# EAGLE design proto (EAGLE 6.6.0)
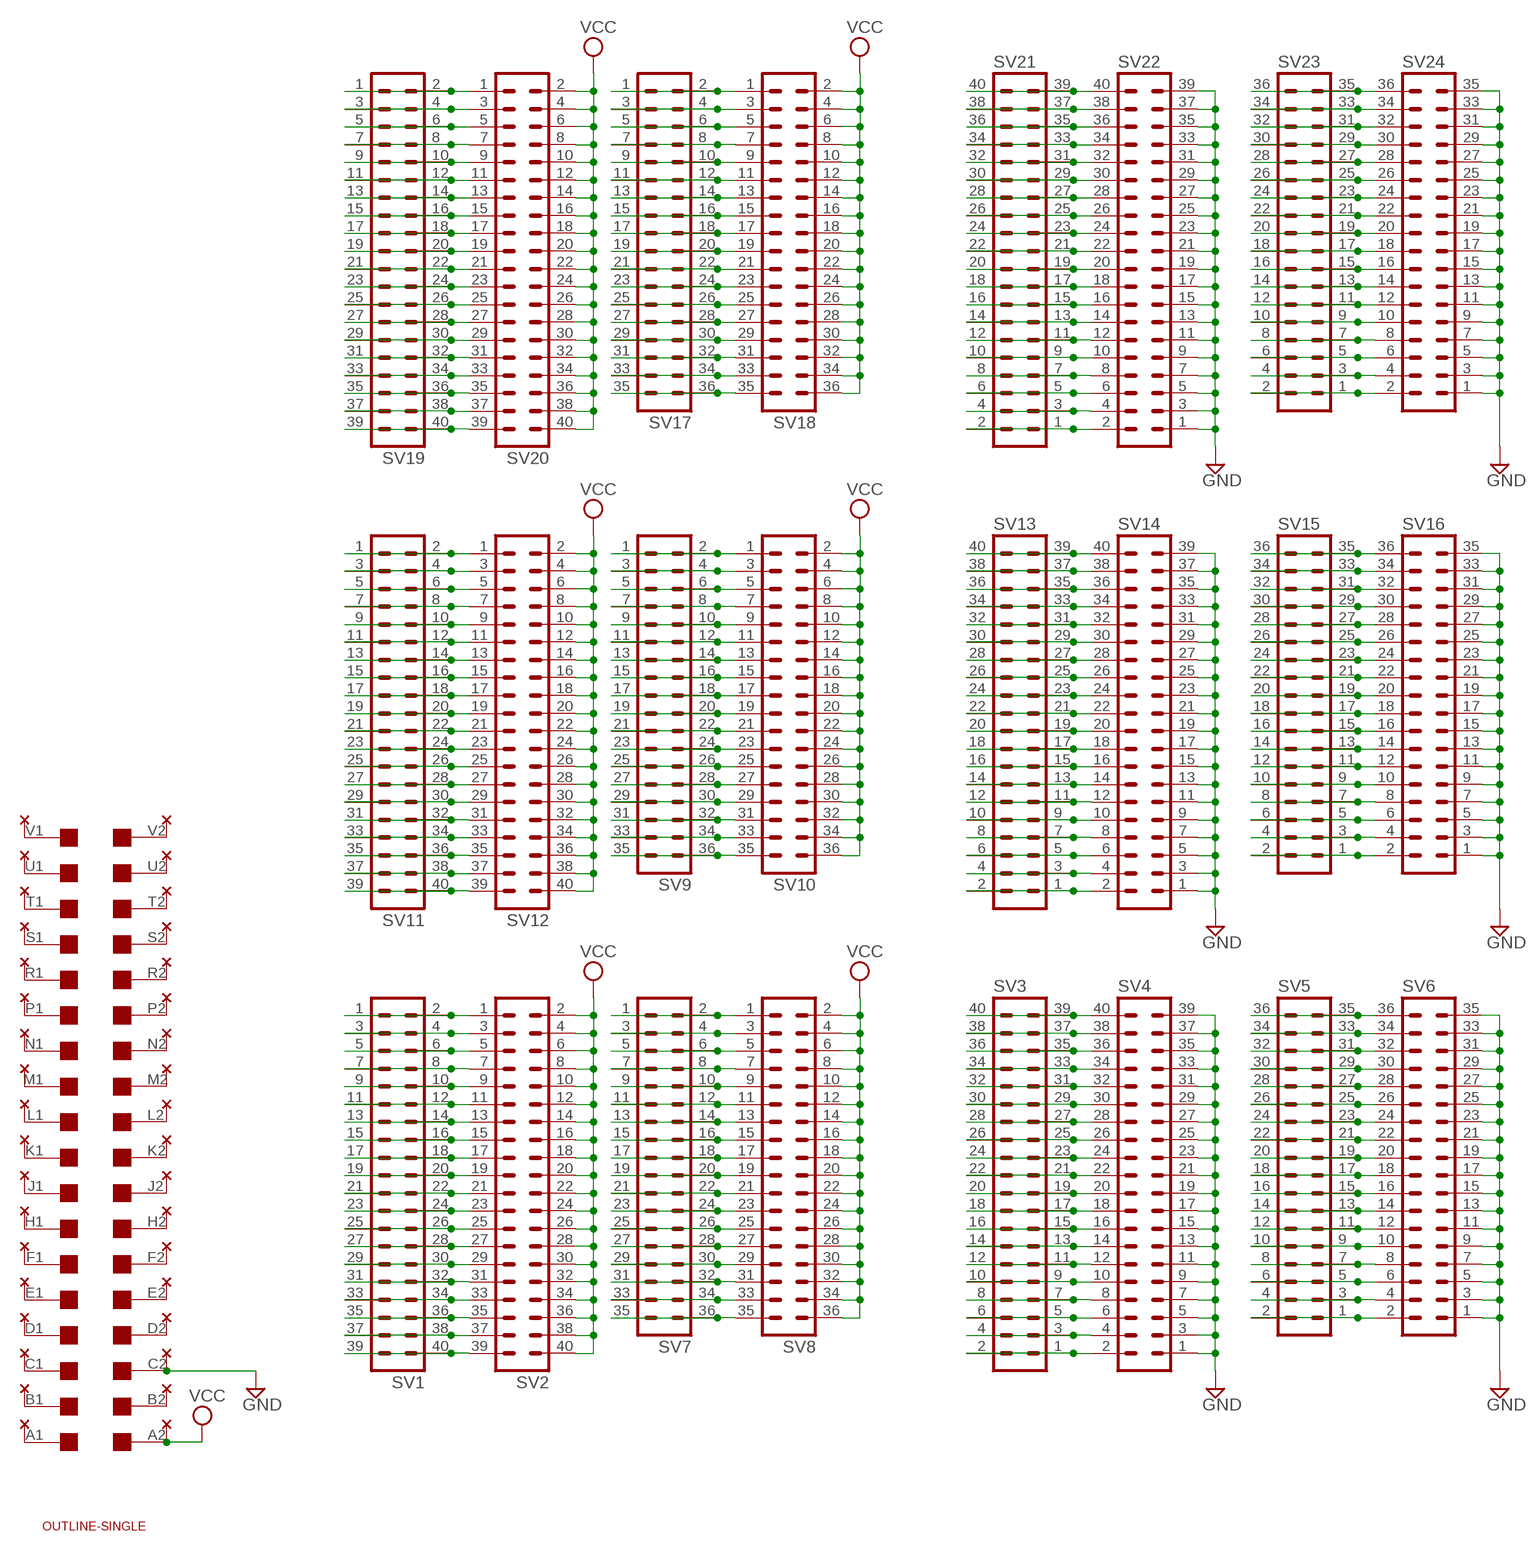
[diagram p0: schematic, sheet 1]

## Parts
SV1  MA20-2  [MA20-2]
SV2  MA20-2  [MA20-2]
SV3  MA20-2  [MA20-2]
SV4  MA20-2  [MA20-2]
SV5  MA18-2  [MA18-2]
SV6  MA18-2  [MA18-2]
SV7  MA18-2  [MA18-2]
SV8  MA18-2  [MA18-2]
SV9  MA18-2  [MA18-2]
SV10  MA18-2  [MA18-2]
SV11  MA20-2  [MA20-2]
SV12  MA20-2  [MA20-2]
SV13  MA20-2  [MA20-2]
SV14  MA20-2  [MA20-2]
SV15  MA18-2  [MA18-2]
SV16  MA18-2  [MA18-2]
SV17  MA18-2  [MA18-2]
SV18  MA18-2  [MA18-2]
SV19  MA20-2  [MA20-2]
SV20  MA20-2  [MA20-2]
SV21  MA20-2  [MA20-2]
SV22  MA20-2  [MA20-2]
SV23  MA18-2  [MA18-2]
SV24  MA18-2  [MA18-2]
U$1  EDGE-2CONNECTOR  [EDGE-CON2]
U$2  OUTLINE-SINGLE  [SINGLE]
U$3  THRU-HOLE2A  [THRU-HOLEA]

## Nets
GND: SV4.1 SV4.3 SV4.5 SV4.7 SV4.9 SV4.11 SV4.13 SV4.15 SV4.17 SV4.19 SV4.21 SV4.23 SV4.25 SV4.27 SV4.29 SV4.31 SV4.33 SV4.35 SV4.37 SV4.39 SV6.1 SV6.3 SV6.5 SV6.7 SV6.9 SV6.11 SV6.13 SV6.15 SV6.17 SV6.19 SV6.21 SV6.23 SV6.25 SV6.27 SV6.29 SV6.31 SV6.33 SV6.35 SV14.1 SV14.3 SV14.5 SV14.7 SV14.9 SV14.11 SV14.13 SV14.15 SV14.17 SV14.19 SV14.21 SV14.23 SV14.25 SV14.27 SV14.29 SV14.31 SV14.33 SV14.35 SV14.37 SV14.39 SV16.1 SV16.3 SV16.5 SV16.7 SV16.9 SV16.11 SV16.13 SV16.15 SV16.17 SV16.19 SV16.21 SV16.23 SV16.25 SV16.27 SV16.29 SV16.31 SV16.33 SV16.35 SV22.1 SV22.3 SV22.5 SV22.7 SV22.9 SV22.11 SV22.13 SV22.15 SV22.17 SV22.19 SV22.21 SV22.23 SV22.25 SV22.27 SV22.29 SV22.31 SV22.33 SV22.35 SV22.37 SV22.39 SV24.1 SV24.3 SV24.5 SV24.7 SV24.9 SV24.11 SV24.13 SV24.15 SV24.17 SV24.19 SV24.21 SV24.23 SV24.25 SV24.27 SV24.29 SV24.31 SV24.33 SV24.35 U$1.C2 U$3.C2
N$1: U$1.K2 U$3.K2
N$2: U$1.J2 U$3.J2
N$3: U$1.H2 U$3.H2
N$4: U$1.L2 U$3.L2
N$5: U$1.M2 U$3.M2
N$6: U$1.N2 U$3.N2
N$7: U$1.P2 U$3.P2
N$8: U$1.F2 U$3.F2
N$9: U$1.E2 U$3.E2
N$10: U$1.D2 U$3.D2
N$11: SV1.1 SV1.2 SV2.1
N$12: U$1.R2 U$3.R2
N$13: U$1.S2 U$3.S2
N$14: U$1.B2 U$3.B2
N$15: SV1.3 SV1.4 SV2.3
N$16: U$1.T2 U$3.T2
N$17: U$1.U2 U$3.U2
N$18: U$1.V2 U$3.V2
N$19: U$1.A1 U$3.A1
N$20: U$1.V1 U$3.V1
N$21: U$1.U1 U$3.U1
N$22: U$1.T1 U$3.T1
N$23: U$1.S1 U$3.S1
N$24: U$1.R1 U$3.R1
N$25: U$1.P1 U$3.P1
N$26: U$1.N1 U$3.N1
N$27: U$1.M1 U$3.M1
N$28: U$1.L1 U$3.L1
N$29: U$1.K1 U$3.K1
N$30: U$1.J1 U$3.J1
N$31: U$1.H1 U$3.H1
N$32: U$1.F1 U$3.F1
N$33: U$1.E1 U$3.E1
N$34: U$1.D1 U$3.D1
N$35: U$1.C1 U$3.C1
N$36: U$1.B1 U$3.B1
N$37: SV1.5 SV1.6 SV2.5
N$38: SV7.1 SV7.2 SV8.1
N$39: SV7.3 SV7.4 SV8.3
N$40: SV7.5 SV7.6 SV8.5
N$41: SV7.7 SV7.8 SV8.7
N$42: SV7.9 SV7.10 SV8.9
N$43: SV7.11 SV7.12 SV8.11
N$44: SV7.13 SV7.14 SV8.13
N$45: SV1.7 SV1.8 SV2.7
N$46: SV1.9 SV1.10 SV2.9
N$47: SV1.11 SV1.12 SV2.11
N$48: SV1.13 SV1.14 SV2.13
N$49: SV1.15 SV1.16 SV2.15
N$50: SV1.17 SV1.18 SV2.17
N$51: SV1.19 SV1.20 SV2.19
N$52: SV1.21 SV1.22 SV2.21
N$53: SV1.23 SV1.24 SV2.23
N$54: SV1.25 SV1.26 SV2.25
N$55: SV1.27 SV1.28 SV2.27
N$56: SV1.29 SV1.30 SV2.29
N$57: SV1.31 SV1.32 SV2.31
N$58: SV1.33 SV1.34 SV2.33
N$59: SV1.35 SV1.36 SV2.35
N$60: SV1.37 SV1.38 SV2.37
N$61: SV1.39 SV1.40 SV2.39
N$62: SV7.15 SV7.16 SV8.15
N$63: SV7.17 SV7.18 SV8.17
N$64: SV7.19 SV7.20 SV8.19
N$65: SV7.21 SV7.22 SV8.21
N$66: SV7.23 SV7.24 SV8.23
N$67: SV7.25 SV7.26 SV8.25
N$68: SV7.27 SV7.28 SV8.27
N$69: SV7.29 SV7.30 SV8.29
N$70: SV7.31 SV7.32 SV8.31
N$71: SV7.33 SV7.34 SV8.33
N$72: SV7.35 SV7.36 SV8.35
N$73: SV3.39 SV3.40 SV4.40
N$74: SV3.37 SV3.38 SV4.38
N$75: SV3.35 SV3.36 SV4.36
N$76: SV3.33 SV3.34 SV4.34
N$77: SV3.31 SV3.32 SV4.32
N$78: SV3.29 SV3.30 SV4.30
N$79: SV3.27 SV3.28 SV4.28
N$80: SV3.25 SV3.26 SV4.26
N$81: SV3.23 SV3.24 SV4.24
N$82: SV3.21 SV3.22 SV4.22
N$83: SV3.19 SV3.20 SV4.20
N$84: SV3.17 SV3.18 SV4.18
N$85: SV3.15 SV3.16 SV4.16
N$86: SV3.13 SV3.14 SV4.14
N$87: SV3.11 SV3.12 SV4.12
N$88: SV3.9 SV3.10 SV4.10
N$89: SV3.7 SV3.8 SV4.8
N$90: SV3.5 SV3.6 SV4.6
N$91: SV3.3 SV3.4 SV4.4
N$92: SV3.1 SV3.2 SV4.2
N$93: SV11.1 SV11.2 SV12.1
N$94: SV5.35 SV5.36 SV6.36
N$95: SV5.33 SV5.34 SV6.34
N$96: SV5.31 SV5.32 SV6.32
N$97: SV5.29 SV5.30 SV6.30
N$98: SV5.27 SV5.28 SV6.28
N$99: SV5.25 SV5.26 SV6.26
N$100: SV5.23 SV5.24 SV6.24
N$101: SV5.21 SV5.22 SV6.22
N$102: SV5.19 SV5.20 SV6.20
N$103: SV5.17 SV5.18 SV6.18
N$104: SV5.15 SV5.16 SV6.16
N$105: SV5.13 SV5.14 SV6.14
N$106: SV5.11 SV5.12 SV6.12
N$107: SV5.9 SV5.10 SV6.10
N$108: SV5.7 SV5.8 SV6.8
N$109: SV5.5 SV5.6 SV6.6
N$110: SV5.3 SV5.4 SV6.4
N$111: SV5.1 SV5.2 SV6.2
N$112: SV11.3 SV11.4 SV12.3
N$113: SV11.5 SV11.6 SV12.5
N$114: SV11.7 SV11.8 SV12.7
N$115: SV11.9 SV11.10 SV12.9
N$116: SV11.11 SV11.12 SV12.11
N$117: SV11.13 SV11.14 SV12.13
N$118: SV11.15 SV11.16 SV12.15
N$119: SV11.17 SV11.18 SV12.17
N$120: SV11.19 SV11.20 SV12.19
N$121: SV11.21 SV11.22 SV12.21
N$122: SV11.23 SV11.24 SV12.23
N$123: SV11.25 SV11.26 SV12.25
N$124: SV11.27 SV11.28 SV12.27
N$125: SV11.29 SV11.30 SV12.29
N$126: SV11.31 SV11.32 SV12.31
N$127: SV11.33 SV11.34 SV12.33
N$128: SV11.35 SV11.36 SV12.35
N$129: SV11.37 SV11.38 SV12.37
N$130: SV11.39 SV11.40 SV12.39
N$131: SV9.1 SV9.2 SV10.1
N$132: SV9.3 SV9.4 SV10.3
N$133: SV9.5 SV9.6 SV10.5
N$134: SV9.7 SV9.8 SV10.7
N$135: SV9.9 SV9.10 SV10.9
N$136: SV9.11 SV9.12 SV10.11
N$137: SV9.13 SV9.14 SV10.13
N$138: SV9.15 SV9.16 SV10.15
N$139: SV9.17 SV9.18 SV10.17
N$140: SV9.19 SV9.20 SV10.19
N$141: SV9.21 SV9.22 SV10.21
N$142: SV9.23 SV9.24 SV10.23
N$143: SV9.25 SV9.26 SV10.25
N$144: SV9.27 SV9.28 SV10.27
N$145: SV9.29 SV9.30 SV10.29
N$146: SV9.31 SV9.32 SV10.31
N$147: SV9.33 SV9.34 SV10.33
N$148: SV9.35 SV9.36 SV10.35
N$149: SV13.39 SV13.40 SV14.40
N$150: SV13.37 SV13.38 SV14.38
N$151: SV13.35 SV13.36 SV14.36
N$152: SV13.33 SV13.34 SV14.34
N$153: SV13.31 SV13.32 SV14.32
N$154: SV13.29 SV13.30 SV14.30
N$155: SV13.27 SV13.28 SV14.28
N$156: SV13.25 SV13.26 SV14.26
N$157: SV13.23 SV13.24 SV14.24
N$158: SV13.21 SV13.22 SV14.22
N$159: SV13.19 SV13.20 SV14.20
N$160: SV13.17 SV13.18 SV14.18
N$161: SV13.15 SV13.16 SV14.16
N$162: SV13.13 SV13.14 SV14.14
N$163: SV13.11 SV13.12 SV14.12
N$164: SV13.9 SV13.10 SV14.10
N$165: SV13.7 SV13.8 SV14.8
N$166: SV13.5 SV13.6 SV14.6
N$167: SV13.3 SV13.4 SV14.4
N$168: SV13.1 SV13.2 SV14.2
N$169: SV15.35 SV15.36 SV16.36
N$170: SV15.33 SV15.34 SV16.34
N$171: SV15.31 SV15.32 SV16.32
N$172: SV15.29 SV15.30 SV16.30
N$173: SV15.27 SV15.28 SV16.28
N$174: SV15.25 SV15.26 SV16.26
N$175: SV15.23 SV15.24 SV16.24
N$176: SV15.21 SV15.22 SV16.22
N$177: SV15.19 SV15.20 SV16.20
N$178: SV15.17 SV15.18 SV16.18
N$179: SV15.15 SV15.16 SV16.16
N$180: SV15.13 SV15.14 SV16.14
N$181: SV15.11 SV15.12 SV16.12
N$182: SV15.9 SV15.10 SV16.10
N$183: SV15.7 SV15.8 SV16.8
N$184: SV15.5 SV15.6 SV16.6
N$185: SV15.3 SV15.4 SV16.4
N$186: SV15.1 SV15.2 SV16.2
N$187: SV19.1 SV19.2 SV20.1
N$188: SV19.3 SV19.4 SV20.3
N$189: SV19.5 SV19.6 SV20.5
N$190: SV19.7 SV19.8 SV20.7
N$191: SV19.9 SV19.10 SV20.9
N$192: SV19.11 SV19.12 SV20.11
N$193: SV19.13 SV19.14 SV20.13
N$194: SV19.15 SV19.16 SV20.15
N$195: SV19.17 SV19.18 SV20.17
N$196: SV19.19 SV19.20 SV20.19
N$197: SV19.21 SV19.22 SV20.21
N$198: SV19.23 SV19.24 SV20.23
N$199: SV19.25 SV19.26 SV20.25
N$200: SV19.27 SV19.28 SV20.27
N$201: SV19.29 SV19.30 SV20.29
N$202: SV19.31 SV19.32 SV20.31
N$203: SV19.33 SV19.34 SV20.33
N$204: SV19.35 SV19.36 SV20.35
N$205: SV19.37 SV19.38 SV20.37
N$206: SV19.39 SV19.40 SV20.39
N$207: SV17.1 SV17.2 SV18.1
N$208: SV17.3 SV17.4 SV18.3
N$209: SV17.5 SV17.6 SV18.5
N$210: SV17.7 SV17.8 SV18.7
N$211: SV17.9 SV17.10 SV18.9
N$212: SV17.11 SV17.12 SV18.11
N$213: SV17.13 SV17.14 SV18.13
N$214: SV17.15 SV17.16 SV18.15
N$215: SV17.17 SV17.18 SV18.17
N$216: SV17.19 SV17.20 SV18.19
N$217: SV17.21 SV17.22 SV18.21
N$218: SV17.23 SV17.24 SV18.23
N$219: SV17.25 SV17.26 SV18.25
N$220: SV17.27 SV17.28 SV18.27
N$221: SV17.29 SV17.30 SV18.29
N$222: SV17.31 SV17.32 SV18.31
N$223: SV17.33 SV17.34 SV18.33
N$224: SV17.35 SV17.36 SV18.35
N$225: SV21.39 SV21.40 SV22.40
N$226: SV21.37 SV21.38 SV22.38
N$227: SV21.35 SV21.36 SV22.36
N$228: SV21.33 SV21.34 SV22.34
N$229: SV21.31 SV21.32 SV22.32
N$230: SV21.29 SV21.30 SV22.30
N$231: SV21.27 SV21.28 SV22.28
N$232: SV21.25 SV21.26 SV22.26
N$233: SV21.23 SV21.24 SV22.24
N$234: SV21.21 SV21.22 SV22.22
N$235: SV21.19 SV21.20 SV22.20
N$236: SV21.17 SV21.18 SV22.18
N$237: SV21.15 SV21.16 SV22.16
N$238: SV21.13 SV21.14 SV22.14
N$239: SV21.11 SV21.12 SV22.12
N$240: SV21.9 SV21.10 SV22.10
N$241: SV21.7 SV21.8 SV22.8
N$242: SV21.5 SV21.6 SV22.6
N$243: SV21.3 SV21.4 SV22.4
N$244: SV21.1 SV21.2 SV22.2
N$245: SV23.35 SV23.36 SV24.36
N$246: SV23.33 SV23.34 SV24.34
N$247: SV23.31 SV23.32 SV24.32
N$248: SV23.29 SV23.30 SV24.30
N$249: SV23.27 SV23.28 SV24.28
N$250: SV23.25 SV23.26 SV24.26
N$251: SV23.23 SV23.24 SV24.24
N$252: SV23.21 SV23.22 SV24.22
N$253: SV23.19 SV23.20 SV24.20
N$254: SV23.17 SV23.18 SV24.18
N$255: SV23.15 SV23.16 SV24.16
N$256: SV23.13 SV23.14 SV24.14
N$257: SV23.11 SV23.12 SV24.12
N$258: SV23.9 SV23.10 SV24.10
N$259: SV23.7 SV23.8 SV24.8
N$260: SV23.5 SV23.6 SV24.6
N$261: SV23.3 SV23.4 SV24.4
N$262: SV23.1 SV23.2 SV24.2
VCC: SV2.2 SV2.4 SV2.6 SV2.8 SV2.10 SV2.12 SV2.14 SV2.16 SV2.18 SV2.20 SV2.22 SV2.24 SV2.26 SV2.28 SV2.30 SV2.32 SV2.34 SV2.36 SV2.38 SV2.40 SV8.2 SV8.4 SV8.6 SV8.8 SV8.10 SV8.12 SV8.14 SV8.16 SV8.18 SV8.20 SV8.22 SV8.24 SV8.26 SV8.28 SV8.30 SV8.32 SV8.34 SV8.36 SV10.2 SV10.4 SV10.6 SV10.8 SV10.10 SV10.12 SV10.14 SV10.16 SV10.18 SV10.20 SV10.22 SV10.24 SV10.26 SV10.28 SV10.30 SV10.32 SV10.34 SV10.36 SV12.2 SV12.4 SV12.6 SV12.8 SV12.10 SV12.12 SV12.14 SV12.16 SV12.18 SV12.20 SV12.22 SV12.24 SV12.26 SV12.28 SV12.30 SV12.32 SV12.34 SV12.36 SV12.38 SV12.40 SV18.2 SV18.4 SV18.6 SV18.8 SV18.10 SV18.12 SV18.14 SV18.16 SV18.18 SV18.20 SV18.22 SV18.24 SV18.26 SV18.28 SV18.30 SV18.32 SV18.34 SV18.36 SV20.2 SV20.4 SV20.6 SV20.8 SV20.10 SV20.12 SV20.14 SV20.16 SV20.18 SV20.20 SV20.22 SV20.24 SV20.26 SV20.28 SV20.30 SV20.32 SV20.34 SV20.36 SV20.38 SV20.40 U$1.A2 U$3.A2

## Library data of the parts
SV1-SV4 SV11-SV14 SV19-SV22 = con-lstb:MA20-2: PIN HEADER; OC_FARNELL: unknown; OC_NEWARK: unknown
SV5-SV10 SV15-SV18 SV23 SV24 = con-lstb:MA18-2: PIN HEADER; OC_FARNELL: unknown; OC_NEWARK: unknown
U$1 = dec-con:EDGE-2: Double-Sided DEC edge connector.
U$2 = dec-con:OUTLINE-*: Board outlines for DEC boards.
U$3 = dec-con:THRU-HOLE2: Thru-Hole addition to double-sided edge connector.

## Net classes
0 default: width 0.635 mm

## Board
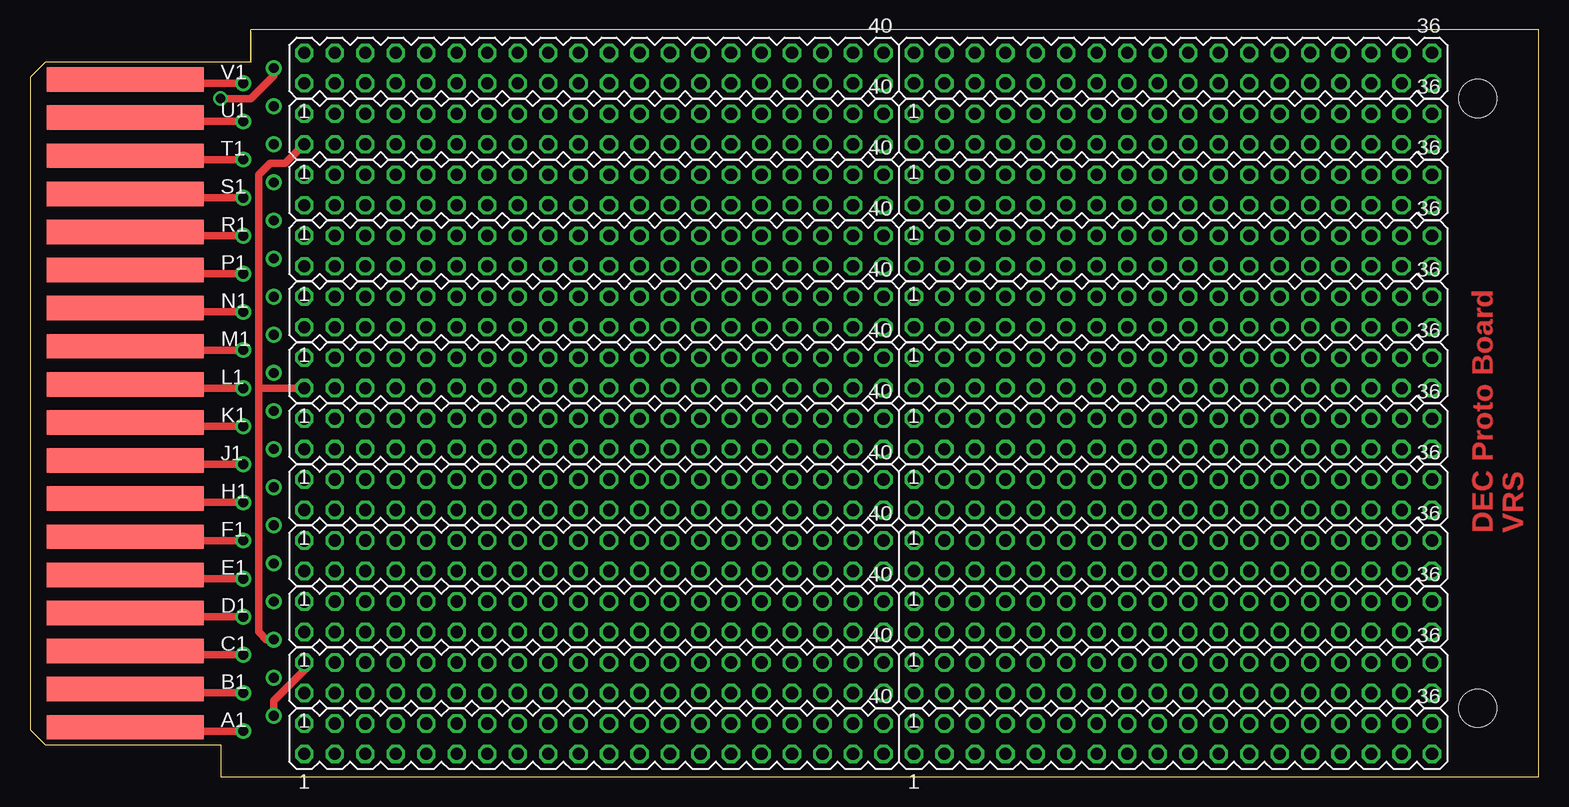
[diagram p1: board, top side]
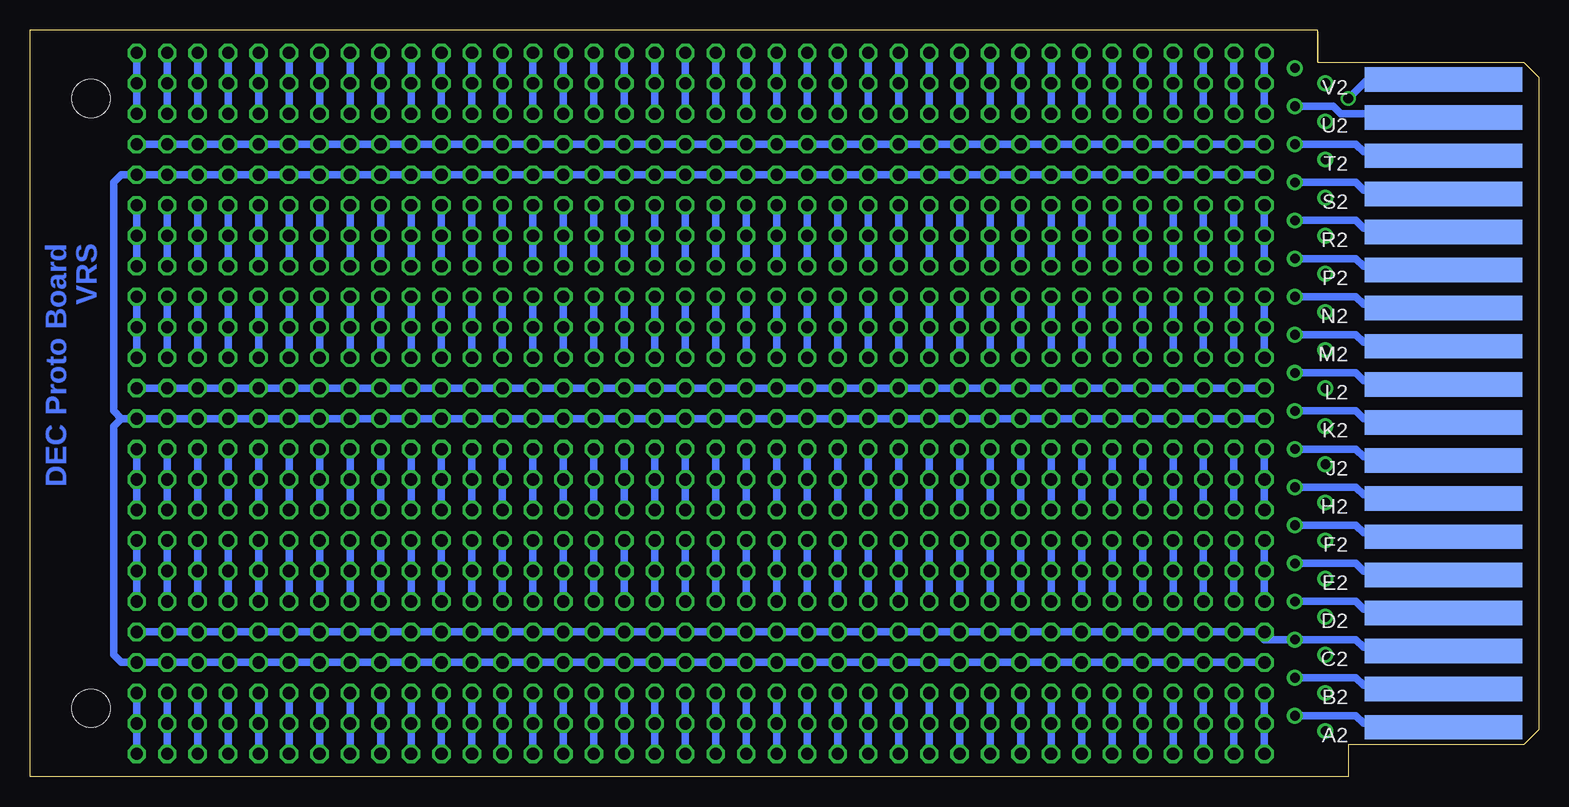
[diagram p2: board, bottom side, seen from below]

Size 125.73 x 62.23 mm. Coordinates in mm from the lower left corner, seen from the top.
Copper layers (1+16): Top 0.035mm / dielectric 1.5mm / Bottom 0.035mm
Design rules "16mils": minimum track width 16mil, minimum drill 32mil, track to track 15mil, track to pad 10mil, pad to pad 10mil, via to via 10mil, smd to smd 10mil, copper to edge 13mil, drill to drill 10mil, minimum pad ring 10mil, minimum via ring 8mil, stop-mask expansion 0mil, vias tented up to drill 0mil, thermal gap 10mil

### Footprints (pad centres in the part's own frame; a part is rotated, then mirrored left to right if it is on the bottom)
MA20-2 = drill 1.016 octagon: 1 -24.13,-1.27; 2 -24.13,1.27; 3 -21.59,-1.27; 4 -21.59,1.27; 5 -19.05,-1.27; 6 -19.05,1.27; 7 -16.51,-1.27; 8 -16.51,1.27; 9 -13.97,-1.27; 10 -13.97,1.27; 11 -11.43,-1.27; 12 -11.43,1.27; 13 -8.89,-1.27; 14 -8.89,1.27; 15 -6.35,-1.27; 16 -6.35,1.27; 17 -3.81,-1.27; 18 -3.81,1.27; 19 -1.27,-1.27; 20 -1.27,1.27; 21 1.27,-1.27; 22 1.27,1.27; 23 3.81,-1.27; 24 3.81,1.27; 25 6.35,-1.27; 26 6.35,1.27; 27 8.89,-1.27; 28 8.89,1.27; 29 11.43,-1.27; 30 11.43,1.27; 31 13.97,-1.27; 32 13.97,1.27; 33 16.51,-1.27; 34 16.51,1.27; 35 19.05,-1.27; 36 19.05,1.27; 37 21.59,-1.27; 38 21.59,1.27; 39 24.13,-1.27; 40 24.13,1.27
MA18-2 = drill 1.016 octagon: 1 -21.59,-1.27; 2 -21.59,1.27; 3 -19.05,-1.27; 4 -19.05,1.27; 5 -16.51,-1.27; 6 -16.51,1.27; 7 -13.97,-1.27; 8 -13.97,1.27; 9 -11.43,-1.27; 10 -11.43,1.27; 11 -8.89,-1.27; 12 -8.89,1.27; 13 -6.35,-1.27; 14 -6.35,1.27; 15 -3.81,-1.27; 16 -3.81,1.27; 17 -1.27,-1.27; 18 -1.27,1.27; 19 1.27,-1.27; 20 1.27,1.27; 21 3.81,-1.27; 22 3.81,1.27; 23 6.35,-1.27; 24 6.35,1.27; 25 8.89,-1.27; 26 8.89,1.27; 27 11.43,-1.27; 28 11.43,1.27; 29 13.97,-1.27; 30 13.97,1.27; 31 16.51,-1.27; 32 16.51,1.27; 33 19.05,-1.27; 34 19.05,1.27; 35 21.59,-1.27; 36 21.59,1.27
EDGE-CON2 = smd 13.106 x 2.032: A1 7.938,4.128; B1 7.938,7.303; C1 7.938,10.477; D1 7.938,13.652; E1 7.938,16.828; F1 7.938,20.003; H1 7.938,23.177; J1 7.938,26.352; K1 7.938,29.527; L1 7.938,32.703; M1 7.938,35.877; N1 7.938,39.053; P1 7.938,42.227; R1 7.938,45.403; S1 7.938,48.578; T1 7.938,51.752; U1 7.938,54.928; V1 7.938,58.102 | smd 13.106 x 2.032 bottom: A2 7.938,4.128; B2 7.938,7.303; C2 7.938,10.477; D2 7.938,13.652; E2 7.938,16.828; F2 7.938,20.003; H2 7.938,23.177; J2 7.938,26.352; K2 7.938,29.527; L2 7.938,32.703; M2 7.938,35.877; N2 7.938,39.053; P2 7.938,42.227; R2 7.938,45.403; S2 7.938,48.578; T2 7.938,51.752; U2 7.938,54.928; V2 7.938,58.102
SINGLE = hole 3.175: 120.65,56.515; 120.65,5.715
THRU-HOLEA = drill 0.813 pad 1.27: A1 17.78,3.81; A2 20.32,5.08; B1 17.78,6.985; B2 20.32,8.255; C1 17.78,10.16; C2 20.32,11.43; D1 17.78,13.335; D2 20.32,14.605; E1 17.78,16.51; E2 20.32,17.78; F1 17.78,19.685; F2 20.32,20.955; H1 17.78,22.86; H2 20.32,24.13; J1 17.78,26.035; J2 20.32,27.305; K1 17.78,29.21; K2 20.32,30.48; L1 17.78,32.385; L2 20.32,33.655; M1 17.78,35.56; M2 20.32,36.83; N1 17.78,38.735; N2 20.32,40.005; P1 17.78,41.91; P2 20.32,43.18; R1 17.78,45.085; R2 20.32,46.355; S1 17.78,48.26; S2 20.32,49.53; T1 17.78,51.435; T2 20.32,52.705; U1 17.78,54.61; U2 20.32,55.88; V1 17.78,57.785; V2 20.32,59.055

### Placement (x,y rotation side)
SV1  46.99,3.17 0 top
SV2  46.99,8.26 0 top
SV3  46.99,18.41 0 top
SV4  46.99,13.34 0 top
SV5  95.25,18.41 0 top
SV6  95.25,13.34 0 top
SV7  95.25,3.17 0 top
SV8  95.25,8.26 0 top
SV9  95.25,23.5 0 top
SV10  95.25,28.57 0 top
SV11  46.99,23.5 0 top
SV12  46.99,28.57 0 top
SV13  46.99,38.73 0 top
SV14  46.99,33.66 0 top
SV15  95.25,38.73 0 top
SV16  95.25,33.66 0 top
SV17  95.25,43.81 0 top
SV18  95.25,48.9 0 top
SV19  46.99,43.81 0 top
SV20  46.99,48.9 0 top
SV21  46.99,59.05 0 top
SV22  46.99,53.98 0 top
SV23  95.25,59.05 0 top
SV24  95.25,53.98 0 top
U$1  0,0 0 top
U$2  0,0 0 top
U$3  0,0 0 top

### Tracks (layer width: path | path; a pad name or v marks a point on that pad's centre or on a via)
GND
  Top 0.635: SV22.1 21.27,51.12 20,51.12 19.05,50.16 19.05,32.38 | 19.05,32.38 19.05,12.06 19.69,11.43 U$3.C2 | 19.05,32.38 SV14.1
  Bottom 0.635: SV14.1 SV14.3 SV14.5 SV14.7 SV14.9 SV14.11 SV14.13 SV14.15 SV14.17 SV14.19 SV14.21 SV14.23 SV14.25 SV14.27 SV14.29 SV14.31 SV14.33 SV14.35 SV14.37 SV14.39 SV16.1 SV16.3 SV16.5 SV16.7 SV16.9 SV16.11 SV16.13 SV16.15 SV16.17 SV16.19 SV16.21 SV16.23 SV16.25 SV16.27 SV16.29 SV16.31 SV16.33 SV16.35 | SV22.1 SV22.3 SV22.5 SV22.7 SV22.9 SV22.11 SV22.13 SV22.15 SV22.17 SV22.19 SV22.21 SV22.23 SV22.25 SV22.27 SV22.29 SV22.31 SV22.33 SV22.35 SV22.37 SV22.39 SV24.1 SV24.3 SV24.5 SV24.7 SV24.9 SV24.11 SV24.13 SV24.15 SV24.17 SV24.19 SV24.21 SV24.23 SV24.25 SV24.27 SV24.29 SV24.31 SV24.33 SV24.35 | SV6.35 SV6.33 SV6.31 SV6.29 SV6.27 SV6.25 SV6.23 SV6.21 SV6.19 SV6.17 SV6.15 SV6.13 SV6.11 SV6.9 SV6.7 SV6.5 SV6.3 SV6.1 SV4.39 SV4.37 SV4.35 SV4.33 SV4.31 SV4.29 SV4.27 SV4.25 SV4.23 SV4.21 SV4.19 SV4.17 SV4.15 SV4.13 SV4.11 SV4.9 SV4.7 SV4.5 SV4.3 SV4.1 22.86,11.43 U$3.C2 15.24,11.43 14.61,10.79 U$1.C2
N$1
  Bottom 0.635: U$3.K2 15.24,30.48 14.61,29.84 U$1.K2
N$2
  Bottom 0.635: U$3.J2 15.24,27.3 14.61,26.67 U$1.J2
N$3
  Bottom 0.635: U$3.H2 15.24,24.13 14.61,23.5 U$1.H2
N$4
  Bottom 0.635: U$3.L2 15.24,33.66 14.61,33.02 U$1.L2
N$5
  Bottom 0.635: U$3.M2 15.24,36.83 14.61,36.2 U$1.M2
N$6
  Bottom 0.635: U$3.N2 15.24,40.01 14.61,39.37 U$1.N2
N$7
  Bottom 0.635: U$3.P2 15.24,43.18 14.61,42.55 U$1.P2
N$8
  Bottom 0.635: U$3.F2 15.24,20.95 14.61,20.32 U$1.F2
N$9
  Bottom 0.635: U$3.E2 15.24,17.78 14.61,17.14 U$1.E2
N$10
  Bottom 0.635: U$3.D2 15.24,14.61 14.61,13.97 U$1.D2
N$11
  Bottom 0.635: SV1.1 22.86,2.54 22.86,3.81 SV1.2 22.86,5.08 22.86,6.35 SV2.1
N$12
  Bottom 0.635: U$3.R2 15.24,46.35 14.61,45.72 U$1.R2
N$13
  Bottom 0.635: U$3.S2 15.24,49.53 14.61,48.9 U$1.S2
N$14
  Bottom 0.635: U$3.B2 15.24,8.26 14.61,7.62 U$1.B2
N$15
  Bottom 0.635: SV1.3 25.4,2.54 25.4,3.81 SV1.4 25.4,5.08 25.4,6.35 SV2.3
N$16
  Bottom 0.635: U$3.T2 15.24,52.7 14.61,52.07 U$1.T2
N$17
  Bottom 0.635: U$3.U2 19.69,55.88 17.15,55.88 16.51,55.24 13.97,55.24 U$1.U2
N$18  (via drill 0.81)
  Top 0.635: v15.88,56.52 18.42,56.52 20.32,58.42 U$3.V2
  Bottom 0.635: v15.88,56.52 13.97,58.42 U$1.V2
N$19
  Top 0.635: U$3.A1 17.15,3.81 13.97,3.81 U$1.A1
N$20
  Top 0.635: U$3.V1 17.15,57.78 13.97,57.78 U$1.V1
N$21
  Top 0.635: U$3.U1 17.15,54.61 13.97,54.61 U$1.U1
N$22
  Top 0.635: U$3.T1 17.15,51.44 13.97,51.44 U$1.T1
N$23
  Top 0.635: U$3.S1 17.15,48.26 13.97,48.26 U$1.S1
N$24
  Top 0.635: U$3.R1 17.15,45.09 13.97,45.09 U$1.R1
N$25
  Top 0.635: U$3.P1 17.15,41.91 13.97,41.91 U$1.P1
N$26
  Top 0.635: U$3.N1 17.15,38.73 13.97,38.73 U$1.N1
N$27
  Top 0.635: U$3.M1 17.15,35.56 13.97,35.56 U$1.M1
N$28
  Top 0.635: U$3.L1 17.15,32.38 13.97,32.38 U$1.L1
N$29
  Top 0.635: U$3.K1 17.15,29.21 13.97,29.21 U$1.K1
N$30
  Top 0.635: U$3.J1 17.15,26.04 13.97,26.04 U$1.J1
N$31
  Top 0.635: U$3.H1 17.15,22.86 13.97,22.86 U$1.H1
N$32
  Top 0.635: U$3.F1 17.15,19.68 13.97,19.68 U$1.F1
N$33
  Top 0.635: U$3.E1 17.15,16.51 13.97,16.51 U$1.E1
N$34
  Top 0.635: U$3.D1 17.15,13.34 13.97,13.34 U$1.D1
N$35
  Top 0.635: U$3.C1 17.15,10.16 13.97,10.16 U$1.C1
N$36
  Top 0.635: U$3.B1 17.15,6.99 13.97,6.99 U$1.B1
N$37
  Bottom 0.635: SV1.5 27.94,2.54 27.94,3.81 SV1.6 27.94,5.08 27.94,6.35 SV2.5
N$38
  Bottom 0.635: SV7.1 73.66,2.54 73.66,3.81 SV7.2 73.66,5.08 73.66,6.35 SV8.1
N$39
  Bottom 0.635: SV7.3 76.2,2.54 76.2,3.81 SV7.4 76.2,5.08 76.2,6.35 SV8.3
N$40
  Bottom 0.635: SV7.5 78.74,2.54 78.74,3.81 SV7.6 78.74,5.08 78.74,6.35 SV8.5
N$41
  Bottom 0.635: SV7.7 81.28,2.54 81.28,3.81 SV7.8 81.28,5.08 81.28,6.35 SV8.7
N$42
  Bottom 0.635: SV7.9 83.82,2.54 83.82,3.81 SV7.10 83.82,5.08 83.82,6.35 SV8.9
N$43
  Bottom 0.635: SV7.11 86.36,2.54 86.36,3.81 SV7.12 86.36,5.08 86.36,6.35 SV8.11
N$44
  Bottom 0.635: SV7.13 88.9,2.54 88.9,3.81 SV7.14 88.9,5.08 88.9,6.35 SV8.13
N$45
  Bottom 0.635: SV1.7 30.48,2.54 30.48,3.81 SV1.8 30.48,5.08 30.48,6.35 SV2.7
N$46
  Bottom 0.635: SV1.9 33.02,2.54 33.02,3.81 SV1.10 33.02,5.08 33.02,6.35 SV2.9
N$47
  Bottom 0.635: SV1.11 35.56,2.54 35.56,3.81 SV1.12 35.56,5.08 35.56,6.35 SV2.11
N$48
  Bottom 0.635: SV1.13 38.1,2.54 38.1,3.81 SV1.14 38.1,5.08 38.1,6.35 SV2.13
N$49
  Bottom 0.635: SV1.15 40.64,2.54 40.64,3.81 SV1.16 40.64,5.08 40.64,6.35 SV2.15
N$50
  Bottom 0.635: SV1.17 43.18,2.54 43.18,3.81 SV1.18 43.18,5.08 43.18,6.35 SV2.17
N$51
  Bottom 0.635: SV1.19 45.72,2.54 45.72,3.81 SV1.20 45.72,5.08 45.72,6.35 SV2.19
N$52
  Bottom 0.635: SV1.21 48.26,2.54 48.26,3.81 SV1.22 48.26,5.08 48.26,6.35 SV2.21
N$53
  Bottom 0.635: SV1.23 50.8,2.54 50.8,3.81 SV1.24 50.8,5.08 50.8,6.35 SV2.23
N$54
  Bottom 0.635: SV1.25 53.34,2.54 53.34,3.81 SV1.26 53.34,5.08 53.34,6.35 SV2.25
N$55
  Bottom 0.635: SV1.27 55.88,2.54 55.88,3.81 SV1.28 55.88,5.08 55.88,6.35 SV2.27
N$56
  Bottom 0.635: SV1.29 58.42,2.54 58.42,3.81 SV1.30 58.42,5.08 58.42,6.35 SV2.29
N$57
  Bottom 0.635: SV1.31 60.96,2.54 60.96,3.81 SV1.32 60.96,5.08 60.96,6.35 SV2.31
N$58
  Bottom 0.635: SV1.33 63.5,2.54 63.5,3.81 SV1.34 63.5,5.08 63.5,6.35 SV2.33
N$59
  Bottom 0.635: SV1.35 66.04,2.54 66.04,3.81 SV1.36 66.04,5.08 66.04,6.35 SV2.35
N$60
  Bottom 0.635: SV1.37 68.58,2.54 68.58,3.81 SV1.38 68.58,5.08 68.58,6.35 SV2.37
N$61
  Bottom 0.635: SV1.39 71.12,2.54 71.12,3.81 SV1.40 71.12,5.08 71.12,6.35 SV2.39
N$62
  Bottom 0.635: SV7.15 91.44,2.54 91.44,3.81 SV7.16 91.44,5.08 91.44,6.35 SV8.15
N$63
  Bottom 0.635: SV7.17 93.98,2.54 93.98,3.81 SV7.18 93.98,5.08 93.98,6.35 SV8.17
N$64
  Bottom 0.635: SV7.19 96.52,2.54 96.52,3.81 SV7.20 96.52,5.08 96.52,6.35 SV8.19
N$65
  Bottom 0.635: SV7.21 99.06,2.54 99.06,3.81 SV7.22 99.06,5.08 99.06,6.35 SV8.21
N$66
  Bottom 0.635: SV7.23 101.6,2.54 101.6,3.81 SV7.24 101.6,5.08 101.6,6.35 SV8.23
N$67
  Bottom 0.635: SV7.25 104.14,2.54 104.14,3.81 SV7.26 104.14,5.08 104.14,6.35 SV8.25
N$68
  Bottom 0.635: SV7.27 106.68,2.54 106.68,3.81 SV7.28 106.68,5.08 106.68,6.35 SV8.27
N$69
  Bottom 0.635: SV7.29 109.22,2.54 109.22,3.81 SV7.30 109.22,5.08 109.22,6.35 SV8.29
N$70
  Bottom 0.635: SV7.31 111.76,2.54 111.76,3.81 SV7.32 111.76,5.08 111.76,6.35 SV8.31
N$71
  Bottom 0.635: SV7.33 114.3,2.54 114.3,3.81 SV7.34 114.3,5.08 114.3,6.35 SV8.33
N$72
  Bottom 0.635: SV7.35 116.84,2.54 116.84,3.81 SV7.36 116.84,5.08 116.84,6.35 SV8.35
N$73
  Bottom 0.635: SV4.40 71.12,15.24 71.12,16.51 SV3.39 71.12,17.78 71.12,19.05 SV3.40
N$74
  Bottom 0.635: SV4.38 68.58,15.24 68.58,16.51 SV3.37 68.58,17.78 68.58,19.05 SV3.38
N$75
  Bottom 0.635: SV4.36 66.04,15.24 66.04,16.51 SV3.35 66.04,17.78 66.04,19.05 SV3.36
N$76
  Bottom 0.635: SV4.34 63.5,15.24 63.5,16.51 SV3.33 63.5,17.78 63.5,19.05 SV3.34
N$77
  Bottom 0.635: SV4.32 60.96,15.24 60.96,16.51 SV3.31 60.96,17.78 60.96,19.05 SV3.32
N$78
  Bottom 0.635: SV4.30 58.42,15.24 58.42,16.51 SV3.29 58.42,17.78 58.42,19.05 SV3.30
N$79
  Bottom 0.635: SV4.28 55.88,15.24 55.88,16.51 SV3.27 55.88,17.78 55.88,19.05 SV3.28
N$80
  Bottom 0.635: SV4.26 53.34,15.24 53.34,16.51 SV3.25 53.34,17.78 53.34,19.05 SV3.26
N$81
  Bottom 0.635: SV4.24 50.8,15.24 50.8,16.51 SV3.23 50.8,17.78 50.8,19.05 SV3.24
N$82
  Bottom 0.635: SV4.22 48.26,15.24 48.26,16.51 SV3.21 48.26,17.78 48.26,19.05 SV3.22
N$83
  Bottom 0.635: SV4.20 45.72,15.24 45.72,16.51 SV3.19 45.72,17.78 45.72,19.05 SV3.20
N$84
  Bottom 0.635: SV4.18 43.18,15.24 43.18,16.51 SV3.17 43.18,17.78 43.18,19.05 SV3.18
N$85
  Bottom 0.635: SV4.16 40.64,15.24 40.64,16.51 SV3.15 40.64,17.78 40.64,19.05 SV3.16
N$86
  Bottom 0.635: SV4.14 38.1,15.24 38.1,16.51 SV3.13 38.1,17.78 38.1,19.05 SV3.14
N$87
  Bottom 0.635: SV4.12 35.56,15.24 35.56,16.51 SV3.11 35.56,17.78 35.56,19.05 SV3.12
N$88
  Bottom 0.635: SV4.10 33.02,15.24 33.02,16.51 SV3.9 33.02,17.78 33.02,19.05 SV3.10
N$89
  Bottom 0.635: SV4.8 30.48,15.24 30.48,16.51 SV3.7 30.48,17.78 30.48,19.05 SV3.8
N$90
  Bottom 0.635: SV4.6 27.94,15.24 27.94,16.51 SV3.5 27.94,17.78 27.94,19.05 SV3.6
N$91
  Bottom 0.635: SV4.4 25.4,15.24 25.4,16.51 SV3.3 25.4,17.78 25.4,19.05 SV3.4
N$92
  Bottom 0.635: SV4.2 22.86,15.24 22.86,16.51 SV3.1 22.86,17.78 22.86,19.05 SV3.2
N$93
  Bottom 0.635: SV11.1 22.86,22.86 22.86,24.13 SV11.2 22.86,25.4 22.86,26.67 SV12.1
N$94
  Bottom 0.635: SV6.36 116.84,15.24 116.84,16.51 SV5.35 116.84,17.78 116.84,19.05 SV5.36
N$95
  Bottom 0.635: SV6.34 114.3,15.24 114.3,16.51 SV5.33 114.3,17.78 114.3,19.05 SV5.34
N$96
  Bottom 0.635: SV6.32 111.76,15.24 111.76,16.51 SV5.31 111.76,17.78 111.76,19.05 SV5.32
N$97
  Bottom 0.635: SV6.30 109.22,15.24 109.22,16.51 SV5.29 109.22,17.78 109.22,19.05 SV5.30
N$98
  Bottom 0.635: SV6.28 106.68,15.24 106.68,16.51 SV5.27 106.68,17.78 106.68,19.05 SV5.28
N$99
  Bottom 0.635: SV6.26 104.14,15.24 104.14,16.51 SV5.25 104.14,17.78 104.14,19.05 SV5.26
N$100
  Bottom 0.635: SV6.24 101.6,15.24 101.6,16.51 SV5.23 101.6,17.78 101.6,19.05 SV5.24
N$101
  Bottom 0.635: SV6.22 99.06,15.24 99.06,16.51 SV5.21 99.06,17.78 99.06,19.05 SV5.22
N$102
  Bottom 0.635: SV6.20 96.52,15.24 96.52,16.51 SV5.19 96.52,17.78 96.52,19.05 SV5.20
N$103
  Bottom 0.635: SV6.18 93.98,15.24 93.98,16.51 SV5.17 93.98,17.78 93.98,19.05 SV5.18
N$104
  Bottom 0.635: SV6.16 91.44,15.24 91.44,16.51 SV5.15 91.44,17.78 91.44,19.05 SV5.16
N$105
  Bottom 0.635: SV6.14 88.9,15.24 88.9,16.51 SV5.13 88.9,17.78 88.9,19.05 SV5.14
N$106
  Bottom 0.635: SV6.12 86.36,15.24 86.36,16.51 SV5.11 86.36,17.78 86.36,19.05 SV5.12
N$107
  Bottom 0.635: SV6.10 83.82,15.24 83.82,16.51 SV5.9 83.82,17.78 83.82,19.05 SV5.10
N$108
  Bottom 0.635: SV6.8 81.28,15.24 81.28,16.51 SV5.7 81.28,17.78 81.28,19.05 SV5.8
N$109
  Bottom 0.635: SV6.6 78.74,15.24 78.74,16.51 SV5.5 78.74,17.78 78.74,19.05 SV5.6
N$110
  Bottom 0.635: SV6.4 76.2,15.24 76.2,16.51 SV5.3 76.2,17.78 76.2,19.05 SV5.4
N$111
  Bottom 0.635: SV6.2 73.66,15.24 73.66,16.51 SV5.1 73.66,17.78 73.66,19.05 SV5.2
N$112
  Bottom 0.635: SV11.3 25.4,22.86 25.4,24.13 SV11.4 25.4,25.4 25.4,26.67 SV12.3
N$113
  Bottom 0.635: SV11.5 27.94,22.86 27.94,24.13 SV11.6 27.94,25.4 27.94,26.67 SV12.5
N$114
  Bottom 0.635: SV11.7 30.48,22.86 30.48,24.13 SV11.8 30.48,25.4 30.48,26.67 SV12.7
N$115
  Bottom 0.635: SV11.9 33.02,22.86 33.02,24.13 SV11.10 33.02,25.4 33.02,26.67 SV12.9
N$116
  Bottom 0.635: SV11.11 35.56,22.86 35.56,24.13 SV11.12 35.56,25.4 35.56,26.67 SV12.11
N$117
  Bottom 0.635: SV11.13 38.1,22.86 38.1,24.13 SV11.14 38.1,25.4 38.1,26.67 SV12.13
N$118
  Bottom 0.635: SV11.15 40.64,22.86 40.64,24.13 SV11.16 40.64,25.4 40.64,26.67 SV12.15
N$119
  Bottom 0.635: SV11.17 43.18,22.86 43.18,24.13 SV11.18 43.18,25.4 43.18,26.67 SV12.17
N$120
  Bottom 0.635: SV11.19 45.72,22.86 45.72,24.13 SV11.20 45.72,25.4 45.72,26.67 SV12.19
N$121
  Bottom 0.635: SV11.21 48.26,22.86 48.26,24.13 SV11.22 48.26,25.4 48.26,26.67 SV12.21
N$122
  Bottom 0.635: SV11.23 50.8,22.86 50.8,24.13 SV11.24 50.8,25.4 50.8,26.67 SV12.23
N$123
  Bottom 0.635: SV11.25 53.34,22.86 53.34,24.13 SV11.26 53.34,25.4 53.34,26.67 SV12.25
N$124
  Bottom 0.635: SV11.27 55.88,22.86 55.88,24.13 SV11.28 55.88,25.4 55.88,26.67 SV12.27
N$125
  Bottom 0.635: SV11.29 58.42,22.86 58.42,24.13 SV11.30 58.42,25.4 58.42,26.67 SV12.29
N$126
  Bottom 0.635: SV11.31 60.96,22.86 60.96,24.13 SV11.32 60.96,25.4 60.96,26.67 SV12.31
N$127
  Bottom 0.635: SV11.33 63.5,22.86 63.5,24.13 SV11.34 63.5,25.4 63.5,26.67 SV12.33
N$128
  Bottom 0.635: SV11.35 66.04,22.86 66.04,24.13 SV11.36 66.04,25.4 66.04,26.67 SV12.35
N$129
  Bottom 0.635: SV11.37 68.58,22.86 68.58,24.13 SV11.38 68.58,25.4 68.58,26.67 SV12.37
N$130
  Bottom 0.635: SV11.39 71.12,22.86 71.12,24.13 SV11.40 71.12,25.4 71.12,26.67 SV12.39
N$131
  Bottom 0.635: SV9.1 73.66,22.86 73.66,24.13 SV9.2 73.66,25.4 73.66,26.67 SV10.1
N$132
  Bottom 0.635: SV9.3 76.2,22.86 76.2,24.13 SV9.4 76.2,25.4 76.2,26.67 SV10.3
N$133
  Bottom 0.635: SV9.5 78.74,22.86 78.74,24.13 SV9.6 78.74,25.4 78.74,26.67 SV10.5
N$134
  Bottom 0.635: SV9.7 81.28,22.86 81.28,24.13 SV9.8 81.28,25.4 81.28,26.67 SV10.7
N$135
  Bottom 0.635: SV9.9 83.82,22.86 83.82,24.13 SV9.10 83.82,25.4 83.82,26.67 SV10.9
N$136
  Bottom 0.635: SV9.11 86.36,22.86 86.36,24.13 SV9.12 86.36,25.4 86.36,26.67 SV10.11
N$137
  Bottom 0.635: SV9.13 88.9,22.86 88.9,24.13 SV9.14 88.9,25.4 88.9,26.67 SV10.13
N$138
  Bottom 0.635: SV9.15 91.44,22.86 91.44,24.13 SV9.16 91.44,25.4 91.44,26.67 SV10.15
N$139
  Bottom 0.635: SV9.17 93.98,22.86 93.98,24.13 SV9.18 93.98,25.4 93.98,26.67 SV10.17
N$140
  Bottom 0.635: SV9.19 96.52,22.86 96.52,24.13 SV9.20 96.52,25.4 96.52,26.67 SV10.19
N$141
  Bottom 0.635: SV9.21 99.06,22.86 99.06,24.13 SV9.22 99.06,25.4 99.06,26.67 SV10.21
N$142
  Bottom 0.635: SV9.23 101.6,22.86 101.6,24.13 SV9.24 101.6,25.4 101.6,26.67 SV10.23
N$143
  Bottom 0.635: SV9.25 104.14,22.86 104.14,24.13 SV9.26 104.14,25.4 104.14,26.67 SV10.25
N$144
  Bottom 0.635: SV9.27 106.68,22.86 106.68,24.13 SV9.28 106.68,25.4 106.68,26.67 SV10.27
N$145
  Bottom 0.635: SV9.29 109.22,22.86 109.22,24.13 SV9.30 109.22,25.4 109.22,26.67 SV10.29
N$146
  Bottom 0.635: SV9.31 111.76,22.86 111.76,24.13 SV9.32 111.76,25.4 111.76,26.67 SV10.31
N$147
  Bottom 0.635: SV9.33 114.3,22.86 114.3,24.13 SV9.34 114.3,25.4 114.3,26.67 SV10.33
N$148
  Bottom 0.635: SV9.35 116.84,22.86 116.84,24.13 SV9.36 116.84,25.4 116.84,26.67 SV10.35
N$149
  Bottom 0.635: SV14.40 71.12,35.56 71.12,36.83 SV13.39 71.12,38.1 71.12,39.37 SV13.40
N$150
  Bottom 0.635: SV14.38 68.58,35.56 68.58,36.83 SV13.37 68.58,38.1 68.58,39.37 SV13.38
N$151
  Bottom 0.635: SV14.36 66.04,35.56 66.04,36.83 SV13.35 66.04,38.1 66.04,39.37 SV13.36
N$152
  Bottom 0.635: SV14.34 63.5,35.56 63.5,36.83 SV13.33 63.5,38.1 63.5,39.37 SV13.34
N$153
  Bottom 0.635: SV14.32 60.96,35.56 60.96,36.83 SV13.31 60.96,38.1 60.96,39.37 SV13.32
N$154
  Bottom 0.635: SV14.30 58.42,35.56 58.42,36.83 SV13.29 58.42,38.1 58.42,39.37 SV13.30
N$155
  Bottom 0.635: SV14.28 55.88,35.56 55.88,36.83 SV13.27 55.88,38.1 55.88,39.37 SV13.28
N$156
  Bottom 0.635: SV14.26 53.34,35.56 53.34,36.83 SV13.25 53.34,38.1 53.34,39.37 SV13.26
N$157
  Bottom 0.635: SV14.24 50.8,35.56 50.8,36.83 SV13.23 50.8,38.1 50.8,39.37 SV13.24
N$158
  Bottom 0.635: SV14.22 48.26,35.56 48.26,36.83 SV13.21 48.26,38.1 48.26,39.37 SV13.22
N$159
  Bottom 0.635: SV14.20 45.72,35.56 45.72,36.83 SV13.19 45.72,38.1 45.72,39.37 SV13.20
N$160
  Bottom 0.635: SV14.18 43.18,35.56 43.18,36.83 SV13.17 43.18,38.1 43.18,39.37 SV13.18
N$161
  Bottom 0.635: SV14.16 40.64,35.56 40.64,36.83 SV13.15 40.64,38.1 40.64,39.37 SV13.16
N$162
  Bottom 0.635: SV14.14 38.1,35.56 38.1,36.83 SV13.13 38.1,38.1 38.1,39.37 SV13.14
N$163
  Bottom 0.635: SV14.12 35.56,35.56 35.56,36.83 SV13.11 35.56,38.1 35.56,39.37 SV13.12
N$164
  Bottom 0.635: SV14.10 33.02,35.56 33.02,36.83 SV13.9 33.02,38.1 33.02,39.37 SV13.10
N$165
  Bottom 0.635: SV14.8 30.48,35.56 30.48,36.83 SV13.7 30.48,38.1 30.48,39.37 SV13.8
N$166
  Bottom 0.635: SV14.6 27.94,35.56 27.94,36.83 SV13.5 27.94,38.1 27.94,39.37 SV13.6
N$167
  Bottom 0.635: SV14.4 25.4,35.56 25.4,36.83 SV13.3 25.4,38.1 25.4,39.37 SV13.4
N$168
  Bottom 0.635: SV14.2 22.86,35.56 22.86,36.83 SV13.1 22.86,38.1 22.86,39.37 SV13.2
N$169
  Bottom 0.635: SV16.36 116.84,35.56 116.84,36.83 SV15.35 116.84,38.1 116.84,39.37 SV15.36
N$170
  Bottom 0.635: SV16.34 114.3,35.56 114.3,36.83 SV15.33 114.3,38.1 114.3,39.37 SV15.34
N$171
  Bottom 0.635: SV16.32 111.76,35.56 111.76,36.83 SV15.31 111.76,38.1 111.76,39.37 SV15.32
N$172
  Bottom 0.635: SV16.30 109.22,35.56 109.22,36.83 SV15.29 109.22,38.1 109.22,39.37 SV15.30
N$173
  Bottom 0.635: SV16.28 106.68,35.56 106.68,36.83 SV15.27 106.68,38.1 106.68,39.37 SV15.28
N$174
  Bottom 0.635: SV16.26 104.14,35.56 104.14,36.83 SV15.25 104.14,38.1 104.14,39.37 SV15.26
N$175
  Bottom 0.635: SV16.24 101.6,35.56 101.6,36.83 SV15.23 101.6,38.1 101.6,39.37 SV15.24
N$176
  Bottom 0.635: SV16.22 99.06,35.56 99.06,36.83 SV15.21 99.06,38.1 99.06,39.37 SV15.22
N$177
  Bottom 0.635: SV16.20 96.52,35.56 96.52,36.83 SV15.19 96.52,38.1 96.52,39.37 SV15.20
N$178
  Bottom 0.635: SV16.18 93.98,35.56 93.98,36.83 SV15.17 93.98,38.1 93.98,39.37 SV15.18
N$179
  Bottom 0.635: SV16.16 91.44,35.56 91.44,36.83 SV15.15 91.44,38.1 91.44,39.37 SV15.16
N$180
  Bottom 0.635: SV16.14 88.9,35.56 88.9,36.83 SV15.13 88.9,38.1 88.9,39.37 SV15.14
N$181
  Bottom 0.635: SV16.12 86.36,35.56 86.36,36.83 SV15.11 86.36,38.1 86.36,39.37 SV15.12
N$182
  Bottom 0.635: SV16.10 83.82,35.56 83.82,36.83 SV15.9 83.82,38.1 83.82,39.37 SV15.10
N$183
  Bottom 0.635: SV16.8 81.28,35.56 81.28,36.83 SV15.7 81.28,38.1 81.28,39.37 SV15.8
N$184
  Bottom 0.635: SV16.6 78.74,35.56 78.74,36.83 SV15.5 78.74,38.1 78.74,39.37 SV15.6
N$185
  Bottom 0.635: SV16.4 76.2,35.56 76.2,36.83 SV15.3 76.2,38.1 76.2,39.37 SV15.4
N$186
  Bottom 0.635: SV16.2 73.66,35.56 73.66,36.83 SV15.1 73.66,38.1 73.66,39.37 SV15.2
N$187
  Bottom 0.635: SV19.1 22.86,43.18 22.86,44.45 SV19.2 22.86,45.72 22.86,46.99 SV20.1
N$188
  Bottom 0.635: SV19.3 25.4,43.18 25.4,44.45 SV19.4 25.4,45.72 25.4,46.99 SV20.3
N$189
  Bottom 0.635: SV19.5 27.94,43.18 27.94,44.45 SV19.6 27.94,45.72 27.94,46.99 SV20.5
N$190
  Bottom 0.635: SV19.7 30.48,43.18 30.48,44.45 SV19.8 30.48,45.72 30.48,46.99 SV20.7
N$191
  Bottom 0.635: SV19.9 33.02,43.18 33.02,44.45 SV19.10 33.02,45.72 33.02,46.99 SV20.9
N$192
  Bottom 0.635: SV19.11 35.56,43.18 35.56,44.45 SV19.12 35.56,45.72 35.56,46.99 SV20.11
N$193
  Bottom 0.635: SV19.13 38.1,43.18 38.1,44.45 SV19.14 38.1,45.72 38.1,46.99 SV20.13
N$194
  Bottom 0.635: SV19.15 40.64,43.18 40.64,44.45 SV19.16 40.64,45.72 40.64,46.99 SV20.15
N$195
  Bottom 0.635: SV19.17 43.18,43.18 43.18,44.45 SV19.18 43.18,45.72 43.18,46.99 SV20.17
N$196
  Bottom 0.635: SV19.19 45.72,43.18 45.72,44.45 SV19.20 45.72,45.72 45.72,46.99 SV20.19
N$197
  Bottom 0.635: SV19.21 48.26,43.18 48.26,44.45 SV19.22 48.26,45.72 48.26,46.99 SV20.21
N$198
  Bottom 0.635: SV19.23 50.8,43.18 50.8,44.45 SV19.24 50.8,45.72 50.8,46.99 SV20.23
N$199
  Bottom 0.635: SV19.25 53.34,43.18 53.34,44.45 SV19.26 53.34,45.72 53.34,46.99 SV20.25
N$200
  Bottom 0.635: SV19.27 55.88,43.18 55.88,44.45 SV19.28 55.88,45.72 55.88,46.99 SV20.27
N$201
  Bottom 0.635: SV19.29 58.42,43.18 58.42,44.45 SV19.30 58.42,45.72 58.42,46.99 SV20.29
N$202
  Bottom 0.635: SV19.31 60.96,43.18 60.96,44.45 SV19.32 60.96,45.72 60.96,46.99 SV20.31
N$203
  Bottom 0.635: SV19.33 63.5,43.18 63.5,44.45 SV19.34 63.5,45.72 63.5,46.99 SV20.33
N$204
  Bottom 0.635: SV19.35 66.04,43.18 66.04,44.45 SV19.36 66.04,45.72 66.04,46.99 SV20.35
N$205
  Bottom 0.635: SV19.37 68.58,43.18 68.58,44.45 SV19.38 68.58,45.72 68.58,46.99 SV20.37
N$206
  Bottom 0.635: SV19.39 71.12,43.18 71.12,44.45 SV19.40 71.12,45.72 71.12,46.99 SV20.39
N$207
  Bottom 0.635: SV17.1 73.66,43.18 73.66,44.45 SV17.2 73.66,45.72 73.66,46.99 SV18.1
N$208
  Bottom 0.635: SV17.3 76.2,43.18 76.2,44.45 SV17.4 76.2,45.72 76.2,46.99 SV18.3
N$209
  Bottom 0.635: SV17.5 78.74,43.18 78.74,44.45 SV17.6 78.74,45.72 78.74,46.99 SV18.5
N$210
  Bottom 0.635: SV17.7 81.28,43.18 81.28,44.45 SV17.8 81.28,45.72 81.28,46.99 SV18.7
N$211
  Bottom 0.635: SV17.9 83.82,43.18 83.82,44.45 SV17.10 83.82,45.72 83.82,46.99 SV18.9
N$212
  Bottom 0.635: SV17.11 86.36,43.18 86.36,44.45 SV17.12 86.36,45.72 86.36,46.99 SV18.11
N$213
  Bottom 0.635: SV17.13 88.9,43.18 88.9,44.45 SV17.14 88.9,45.72 88.9,46.99 SV18.13
N$214
  Bottom 0.635: SV17.15 91.44,43.18 91.44,44.45 SV17.16 91.44,45.72 91.44,46.99 SV18.15
N$215
  Bottom 0.635: SV17.17 93.98,43.18 93.98,44.45 SV17.18 93.98,45.72 93.98,46.99 SV18.17
N$216
  Bottom 0.635: SV17.19 96.52,43.18 96.52,44.45 SV17.20 96.52,45.72 96.52,46.99 SV18.19
N$217
  Bottom 0.635: SV17.21 99.06,43.18 99.06,44.45 SV17.22 99.06,45.72 99.06,46.99 SV18.21
N$218
  Bottom 0.635: SV17.23 101.6,43.18 101.6,44.45 SV17.24 101.6,45.72 101.6,46.99 SV18.23
N$219
  Bottom 0.635: SV17.25 104.14,43.18 104.14,44.45 SV17.26 104.14,45.72 104.14,46.99 SV18.25
N$220
  Bottom 0.635: SV17.27 106.68,43.18 106.68,44.45 SV17.28 106.68,45.72 106.68,46.99 SV18.27
N$221
  Bottom 0.635: SV17.29 109.22,43.18 109.22,44.45 SV17.30 109.22,45.72 109.22,46.99 SV18.29
N$222
  Bottom 0.635: SV17.31 111.76,43.18 111.76,44.45 SV17.32 111.76,45.72 111.76,46.99 SV18.31
N$223
  Bottom 0.635: SV17.33 114.3,43.18 114.3,44.45 SV17.34 114.3,45.72 114.3,46.99 SV18.33
N$224
  Bottom 0.635: SV17.35 116.84,43.18 116.84,44.45 SV17.36 116.84,45.72 116.84,46.99 SV18.35
N$225
  Bottom 0.635: SV22.40 71.12,55.88 71.12,57.15 SV21.39 71.12,58.42 71.12,59.69 SV21.40
N$226
  Bottom 0.635: SV22.38 68.58,55.88 68.58,57.15 SV21.37 68.58,58.42 68.58,59.69 SV21.38
N$227
  Bottom 0.635: SV22.36 66.04,55.88 66.04,57.15 SV21.35 66.04,58.42 66.04,59.69 SV21.36
N$228
  Bottom 0.635: SV22.34 63.5,55.88 63.5,57.15 SV21.33 63.5,58.42 63.5,59.69 SV21.34
N$229
  Bottom 0.635: SV22.32 60.96,55.88 60.96,57.15 SV21.31 60.96,58.42 60.96,59.69 SV21.32
N$230
  Bottom 0.635: SV22.30 58.42,55.88 58.42,57.15 SV21.29 58.42,58.42 58.42,59.69 SV21.30
N$231
  Bottom 0.635: SV22.28 55.88,55.88 55.88,57.15 SV21.27 55.88,58.42 55.88,59.69 SV21.28
N$232
  Bottom 0.635: SV22.26 53.34,55.88 53.34,57.15 SV21.25 53.34,58.42 53.34,59.69 SV21.26
N$233
  Bottom 0.635: SV22.24 50.8,55.88 50.8,57.15 SV21.23 50.8,58.42 50.8,59.69 SV21.24
N$234
  Bottom 0.635: SV22.22 48.26,55.88 48.26,57.15 SV21.21 48.26,58.42 48.26,59.69 SV21.22
N$235
  Bottom 0.635: SV22.20 45.72,55.88 45.72,57.15 SV21.19 45.72,58.42 45.72,59.69 SV21.20
N$236
  Bottom 0.635: SV22.18 43.18,55.88 43.18,57.15 SV21.17 43.18,58.42 43.18,59.69 SV21.18
N$237
  Bottom 0.635: SV22.16 40.64,55.88 40.64,57.15 SV21.15 40.64,58.42 40.64,59.69 SV21.16
N$238
  Bottom 0.635: SV22.14 38.1,55.88 38.1,57.15 SV21.13 38.1,58.42 38.1,59.69 SV21.14
N$239
  Bottom 0.635: SV22.12 35.56,55.88 35.56,57.15 SV21.11 35.56,58.42 35.56,59.69 SV21.12
N$240
  Bottom 0.635: SV22.10 33.02,55.88 33.02,57.15 SV21.9 33.02,58.42 33.02,59.69 SV21.10
N$241
  Bottom 0.635: SV22.8 30.48,55.88 30.48,57.15 SV21.7 30.48,58.42 30.48,59.69 SV21.8
N$242
  Bottom 0.635: SV22.6 27.94,55.88 27.94,57.15 SV21.5 27.94,58.42 27.94,59.69 SV21.6
N$243
  Bottom 0.635: SV22.4 25.4,55.88 25.4,57.15 SV21.3 25.4,58.42 25.4,59.69 SV21.4
N$244
  Bottom 0.635: SV22.2 22.86,55.88 22.86,57.15 SV21.1 22.86,58.42 22.86,59.69 SV21.2
N$245
  Bottom 0.635: SV24.36 116.84,55.88 116.84,57.15 SV23.35 116.84,58.42 116.84,59.69 SV23.36
N$246
  Bottom 0.635: SV24.34 114.3,55.88 114.3,57.15 SV23.33 114.3,58.42 114.3,59.69 SV23.34
N$247
  Bottom 0.635: SV24.32 111.76,55.88 111.76,57.15 SV23.31 111.76,58.42 111.76,59.69 SV23.32
N$248
  Bottom 0.635: SV24.30 109.22,55.88 109.22,57.15 SV23.29 109.22,58.42 109.22,59.69 SV23.30
N$249
  Bottom 0.635: SV24.28 106.68,55.88 106.68,57.15 SV23.27 106.68,58.42 106.68,59.69 SV23.28
N$250
  Bottom 0.635: SV24.26 104.14,55.88 104.14,57.15 SV23.25 104.14,58.42 104.14,59.69 SV23.26
N$251
  Bottom 0.635: SV24.24 101.6,55.88 101.6,57.15 SV23.23 101.6,58.42 101.6,59.69 SV23.24
N$252
  Bottom 0.635: SV24.22 99.06,55.88 99.06,57.15 SV23.21 99.06,58.42 99.06,59.69 SV23.22
N$253
  Bottom 0.635: SV24.20 96.52,55.88 96.52,57.15 SV23.19 96.52,58.42 96.52,59.69 SV23.20
N$254
  Bottom 0.635: SV24.18 93.98,55.88 93.98,57.15 SV23.17 93.98,58.42 93.98,59.69 SV23.18
N$255
  Bottom 0.635: SV24.16 91.44,55.88 91.44,57.15 SV23.15 91.44,58.42 91.44,59.69 SV23.16
N$256
  Bottom 0.635: SV24.14 88.9,55.88 88.9,57.15 SV23.13 88.9,58.42 88.9,59.69 SV23.14
N$257
  Bottom 0.635: SV24.12 86.36,55.88 86.36,57.15 SV23.11 86.36,58.42 86.36,59.69 SV23.12
N$258
  Bottom 0.635: SV24.10 83.82,55.88 83.82,57.15 SV23.9 83.82,58.42 83.82,59.69 SV23.10
N$259
  Bottom 0.635: SV24.8 81.28,55.88 81.28,57.15 SV23.7 81.28,58.42 81.28,59.69 SV23.8
N$260
  Bottom 0.635: SV24.6 78.74,55.88 78.74,57.15 SV23.5 78.74,58.42 78.74,59.69 SV23.6
N$261
  Bottom 0.635: SV24.4 76.2,55.88 76.2,57.15 SV23.3 76.2,58.42 76.2,59.69 SV23.4
N$262
  Bottom 0.635: SV24.2 73.66,55.88 73.66,57.15 SV23.1 73.66,58.42 73.66,59.69 SV23.2
VCC
  Top 0.635: U$3.A2 20.32,6.35 22.86,8.89 SV2.2
  Bottom 0.635: SV20.2 SV20.4 SV20.6 SV20.8 SV20.10 SV20.12 SV20.14 SV20.16 SV20.18 SV20.20 SV20.22 SV20.24 SV20.26 SV20.28 SV20.30 SV20.32 SV20.34 SV20.36 SV20.38 SV20.40 SV18.2 SV18.4 SV18.6 SV18.8 SV18.10 SV18.12 SV18.14 SV18.16 SV18.18 SV18.20 SV18.22 SV18.24 SV18.26 SV18.28 SV18.30 SV18.32 SV18.34 SV18.36 118.11,50.16 118.75,49.53 118.75,30.48 118.11,29.84 | SV12.2 SV12.4 SV12.6 SV12.8 SV12.10 SV12.12 SV12.14 SV12.16 SV12.18 SV12.20 SV12.22 SV12.24 SV12.26 SV12.28 SV12.30 SV12.32 SV12.34 SV12.36 SV12.38 SV12.40 SV10.2 SV10.4 SV10.6 SV10.8 SV10.10 SV10.12 SV10.14 SV10.16 SV10.18 SV10.20 SV10.22 SV10.24 SV10.26 SV10.28 SV10.30 SV10.32 SV10.34 SV10.36 118.11,29.84 | U$3.A2 15.24,5.08 14.61,4.45 U$1.A2 | SV2.2 SV2.4 SV2.6 SV2.8 SV2.10 SV2.12 SV2.14 SV2.16 SV2.18 SV2.20 SV2.22 SV2.24 SV2.26 SV2.28 SV2.30 SV2.32 SV2.34 SV2.36 SV2.38 SV2.40 SV8.2 SV8.4 SV8.6 SV8.8 SV8.10 SV8.12 SV8.14 SV8.16 SV8.18 SV8.20 SV8.22 SV8.24 SV8.26 SV8.28 SV8.30 SV8.32 SV8.34 SV8.36 118.11,9.53 118.75,10.16 118.75,29.21 118.11,29.84

### Text on the board
Top: DEC Proto Board | VRS
Bottom: VRS | DEC Proto Board